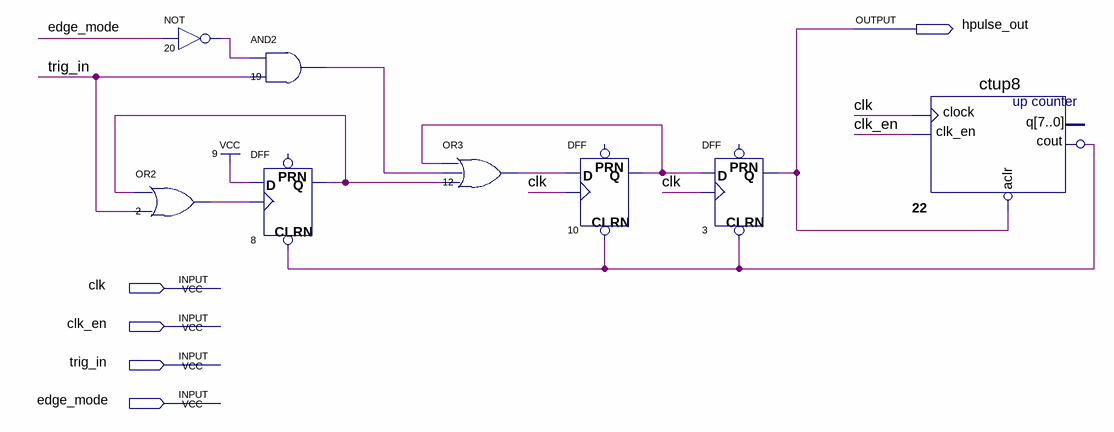
[diagram p0: schematic sheet]
// Quartus schematic mono.bdf as structural Verilog: 8 symbols, 5 pins
module mono (
  input  clk,
  input  clk_en,
  input  trig_in,
  input  edge_mode,
  output hpulse_out
);

  wire n2_out, n8_q, n10_q, n12_out, n19_out, n20_out, n22_cout, n22_cout_inverted_out;

  or u_2 (n2_out, n8_q, trig_in);
  not u_20 (n20_out, edge_mode);
  and u_19 (n19_out, n20_out, trig_in);
  DFF u_8 (.CLRN(n22_cout_inverted_out), .CLK(n2_out), .D(1'b1), .Q(n8_q));  // open: PRN
  or u_12 (n12_out, n10_q, n19_out, n8_q);
  DFF u_10 (.CLRN(n22_cout_inverted_out), .CLK(clk), .D(n12_out), .Q(n10_q));  // open: PRN
  DFF u_3 (.CLRN(n22_cout_inverted_out), .CLK(clk), .D(n10_q), .Q(hpulse_out));  // open: PRN
  ctup8 u_22 (.clock(clk), .clk_en(clk_en), .aclr(~hpulse_out), .cout(n22_cout));  // open: q
  not u_22_cout_inverted (n22_cout_inverted_out, n22_cout);
endmodule
